# EAGLE schematic Schematic_V1 (EAGLE 9.1.3)
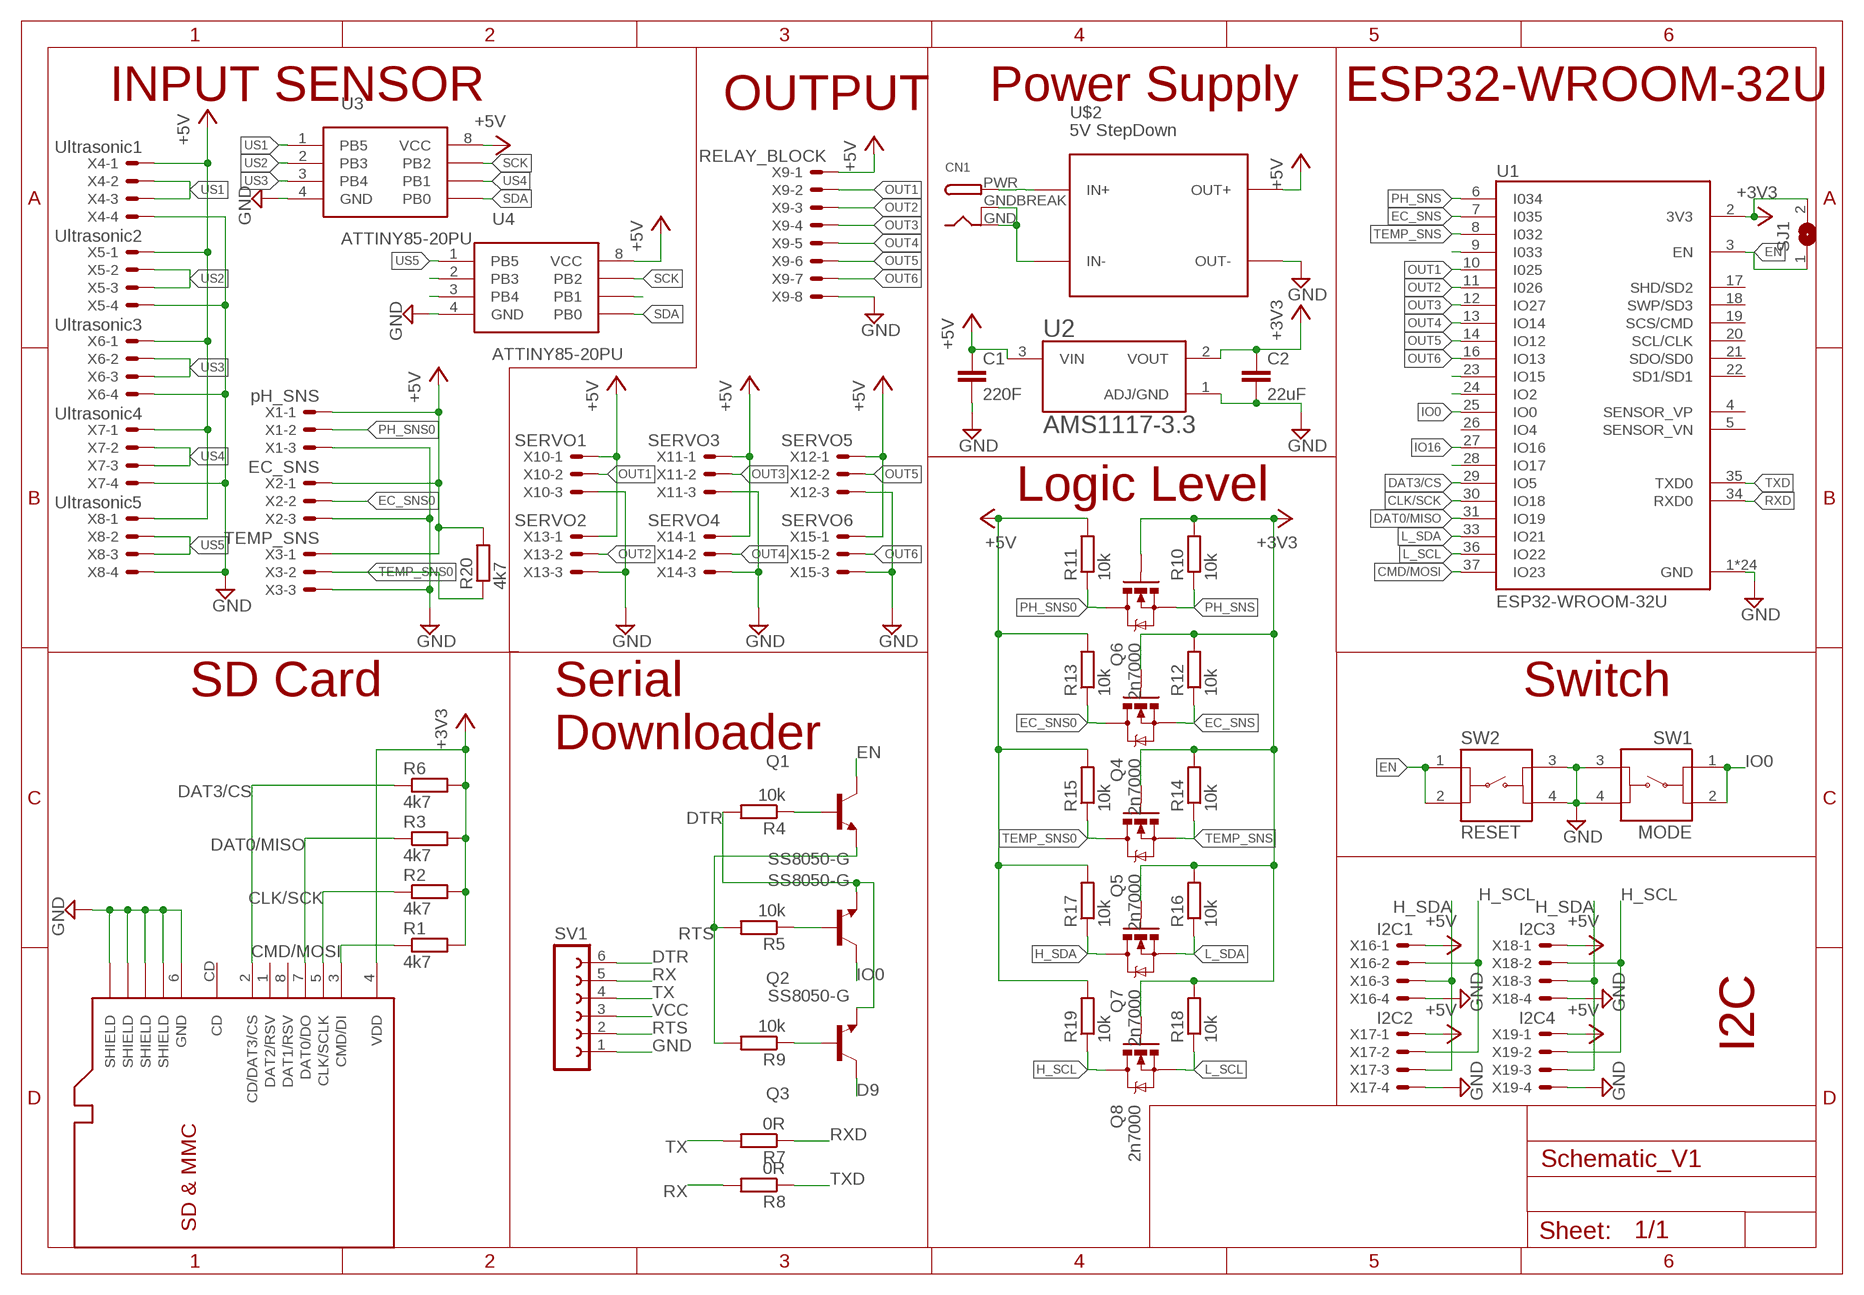
[diagram p0: schematic, sheet 1]

## Parts
C1  220F  C-EUC1206  [C1206]
C2  22uF  C-EUC1206  [C1206]
CN1  DCBARRELPTH  [DCJACK_2MM_PTH]
Q1  SS8050-G  MMBT3904  [SOT23]
Q2  SS8050-G  MMBT3904  [SOT23]
Q3  SS8050-G  MMBT3904  [SOT23]
Q4  2n7000  MOSFET-NCHANNELBSS138  [SOT23]
Q5  2n7000  MOSFET-NCHANNELBSS138  [SOT23]
Q6  2n7000  MOSFET-NCHANNELBSS138  [SOT23]
Q7  2n7000  MOSFET-NCHANNELBSS138  [SOT23]
Q8  2n7000  MOSFET-NCHANNELBSS138  [SOT23]
R1  4k7  R-EU_M1206  [M1206]
R2  4k7  R-EU_M1206  [M1206]
R3  4k7  R-EU_M1206  [M1206]
R4  10k  R-EU_M1206  [M1206]
R5  10k  R-EU_M1206  [M1206]
R6  4k7  R-EU_M1206  [M1206]
R7  0R  R-EU_M1206  [M1206]
R8  0R  R-EU_M1206  [M1206]
R9  10k  R-EU_M1206  [M1206]
R10  10k  R-EU_M1206  [M1206]
R11  10k  R-EU_M1206  [M1206]
R12  10k  R-EU_M1206  [M1206]
R13  10k  R-EU_M1206  [M1206]
R14  10k  R-EU_M1206  [M1206]
R15  10k  R-EU_M1206  [M1206]
R16  10k  R-EU_M1206  [M1206]
R17  10k  R-EU_M1206  [M1206]
R18  10k  R-EU_M1206  [M1206]
R19  10k  R-EU_M1206  [M1206]
R20  4k7  R-EU_M1206  [M1206]
SJ1  SJW  [SJW]
SV1  FE06-1  [FE06]
SW1  MODE  1825910-6  [1825910-6]
SW2  RESET  1825910-6  [1825910-6]
U1  ESP32-WROOM-32U  [XCVR_ESP32-WROOM-32U]
U2  AMS1117-3.3  [SOT229P700X180-4N]
U3  ATTINY85-20PU  [PDIP-8]
U4  ATTINY85-20PU  [PDIP-8]
U$1  MICROSD  [C12075]
U$2  5V StepDown  DC-DC-STEP-DOWN-LM2596  [DC-DC-STEP-DOWN-LM2596]
X1  pH_SNS  JST-XH-03-PIN-LONG-PAD  [JST-XH-03-PACKAGE-LONG-PAD]
X2  EC_SNS  JST-XH-03-PIN-LONG-PAD  [JST-XH-03-PACKAGE-LONG-PAD]
X3  TEMP_SNS  JST-XH-03-PIN-LONG-PAD  [JST-XH-03-PACKAGE-LONG-PAD]
X4  Ultrasonic1  JST-XH-04-PIN-LONG-PAD  [JST-XH-04-PACKAGE-LONG-PAD]
X5  Ultrasonic2  JST-XH-04-PIN-LONG-PAD  [JST-XH-04-PACKAGE-LONG-PAD]
X6  Ultrasonic3  JST-XH-04-PIN-LONG-PAD  [JST-XH-04-PACKAGE-LONG-PAD]
X7  Ultrasonic4  JST-XH-04-PIN-LONG-PAD  [JST-XH-04-PACKAGE-LONG-PAD]
X8  Ultrasonic5  JST-XH-04-PIN-LONG-PAD  [JST-XH-04-PACKAGE-LONG-PAD]
X9  RELAY_BLOCK  JST-XH-08-PIN-LONG-PAD  [JST-XH-08-PACKAGE-LONG-PAD]
X10  SERVO1  JST-XH-03-PIN-LONG-PAD  [JST-XH-03-PACKAGE-LONG-PAD]
X11  SERVO3  JST-XH-03-PIN-LONG-PAD  [JST-XH-03-PACKAGE-LONG-PAD]
X12  SERVO5  JST-XH-03-PIN-LONG-PAD  [JST-XH-03-PACKAGE-LONG-PAD]
X13  SERVO2  JST-XH-03-PIN-LONG-PAD  [JST-XH-03-PACKAGE-LONG-PAD]
X14  SERVO4  JST-XH-03-PIN-LONG-PAD  [JST-XH-03-PACKAGE-LONG-PAD]
X15  SERVO6  JST-XH-03-PIN-LONG-PAD  [JST-XH-03-PACKAGE-LONG-PAD]
X16  I2C1  JST-XH-04-PIN-LONG-PAD  [JST-XH-04-PACKAGE-LONG-PAD]
X17  I2C2  JST-XH-04-PIN-LONG-PAD  [JST-XH-04-PACKAGE-LONG-PAD]
X18  I2C3  JST-XH-04-PIN-LONG-PAD  [JST-XH-04-PACKAGE-LONG-PAD]
X19  I2C4  JST-XH-04-PIN-LONG-PAD  [JST-XH-04-PACKAGE-LONG-PAD]

## Nets
+3V3: C2.1 Q4.1(G) Q5.1(G) Q6.1(G) Q7.1(G) Q8.1(G) R1.2 R2.2 R3.2 R6.2 R10.2 R12.2 R14.2 R16.2 R18.2 SJ1.2 U1.2(3V3) U2.2(VOUT) U$1.4(VDD)
+5V: C1.1 R11.2 R13.2 R15.2 R17.2 R19.2 R20.2 U2.3(VIN) U3.8(VCC) U4.8(VCC) U$2.OUT+ X1.1 X2.1 X3.1 X4.1 X5.1 X6.1 X7.1 X8.1 X9.1 X10.1 X11.1 X12.1 X13.1 X14.1 X15.1 X16.1 X17.1 X18.1 X19.1
CLK/SCK: R2.1 U1.30(IO18) U$1.5(CLK/SCLK)
CMD/MOSI: R1.1 U1.23(IO15) U1.37(IO23) U$1.3(CMD/DI)
D9: Q3.3(C)
DAT0/MISO: R3.1 U1.31(IO19) U$1.7(DAT0/DO)
DAT3/CS: R6.1 U1.29(IO5) U$1.2(CD/DAT3/CS)
DTR: Q2.2(E) Q3.2(E) R4.2 SV1.6
EC_SNS: Q4.2(S) R12.1 U1.7(I035)
EC_SNS0: Q4.3(D) R13.1 X2.2
EN: Q1.3(C) SJ1.1 SW2.1 SW2.2 U1.3(EN)
GND: C1.2 C2.2 SV1.1 SW1.3 SW1.4 SW2.3 SW2.4 U1.1(GND) U1.15(GND) U1.38(GND) U1.G.1(GND) U1.G.2(GND) U1.G.4(GND) U1.G.5(GND) U1.G.6(GND) U1.G.7(GND) U1.G.8(GND) U1.G.9(GND) U1.G.10(GND) U1.G.11(GND) U1.G.12(GND) U1.G.13(GND) U1.G.14(GND) U1.G.15(GND) U1.G.16(GND) U1.G.17(GND) U1.G.18(GND) U1.G.19(GND) U1.G.20(GND) U1.G.21(GND) U1.G.22(GND) U2.1(ADJ/GND) U3.4(GND) U4.4(GND) U$1.6(GND) U$1.GND@1(SHIELD) U$1.GND@2(SHIELD) U$1.GND@3(SHIELD) U$1.GND@4(SHIELD) U$2.OUT- X1.3 X2.3 X3.3 X4.4 X5.4 X6.4 X7.4 X8.4 X9.8 X10.3 X11.3 X12.3 X13.3 X14.3 X15.3 X16.4 X17.4 X18.4 X19.4
H_SCL: Q8.3(D) R19.1 X16.2 X17.2 X18.2 X19.2
H_SDA: Q7.3(D) R17.1 X16.3 X17.3 X18.3 X19.3
IO0: Q2.3(C) SW1.1 SW1.2 U1.25(IO0)
IO16: U1.27(IO16)
L_SCL: Q8.2(S) R18.1 U1.36(IO22)
L_SDA: Q7.2(S) R16.1 U1.33(IO21)
N$1: CN1.PWR U$2.IN+
N$2: Q1.1(B) R4.1
N$3: Q2.1(B) R5.1
N$4: Q3.1(B) R9.1
N$5: U1.9(I033)
N$6: CN1.GND CN1.GNDBREAK U$2.IN-
N$7: U4.6(PB1)
N$12: U4.2(PB3)
N$13: U1.24(IO2)
N$14: U1.28(IO17)
N$15: U4.3(PB4)
OUT1: U1.10(I025) X9.2 X10.2
OUT2: U1.11(I026) X9.3 X13.2
OUT3: U1.12(IO27) X9.4 X11.2
OUT4: U1.13(IO14) X9.5 X14.2
OUT5: U1.14(IO12) X9.6 X12.2
OUT6: U1.16(IO13) X9.7 X15.2
PH_SNS: Q6.2(S) R10.1 U1.6(I034)
PH_SNS0: Q6.3(D) R11.1 X1.2
RTS: Q1.2(E) R5.2 R9.2 SV1.2
RX: R8.2 SV1.5
RXD: R7.1 U1.34(RXD0)
SCK: U3.7(PB2) U4.7(PB2)
SDA: U3.5(PB0) U4.5(PB0)
TEMP_SNS: Q5.2(S) R14.1 U1.8(I032)
TEMP_SNS0: Q5.3(D) R15.1 R20.1 X3.2
TX: R7.2 SV1.4
TXD: R8.1 U1.35(TXD0)
US1: U3.1(PB5) X4.2 X4.3
US2: U3.2(PB3) X5.2 X5.3
US3: U3.3(PB4) X6.2 X6.3
US4: U3.6(PB1) X7.2 X7.3
US5: U4.1(PB5) X8.2 X8.3
VCC: SV1.3
Unconnected: U1.4(SENSOR_VP) U1.5(SENSOR_VN) U1.17(SHD/SD2) U1.18(SWP/SD3) U1.19(SCS/CMD) U1.20(SCL/CLK) U1.21(SDO/SD0) U1.22(SD1/SD1) U1.26(IO4) U$1.1(DAT2/RSV) U$1.8(DAT1/RSV) U$1.CD

## Notes on the sheet
- INPUT SENSOR | OUTPUT | Power Supply | ESP32-WROOM-32U
- Logic Level
- SD Card | Switch
- Serial
  Downloader
- I2C

## Library data of the parts
C1 C2 = rcl:C-EU: CAPACITOR, European symbol; SPICEPREFIX: C
CN1 = adafruit:DCBARREL: 2.0mm DC Barrel Jack DCJACK_2MM_PTH - Through Hole Jack (4UConnector: 05537)
Q1-Q3 = Transistor:MMBT3904: TRANS NPN 40V 0.2A SOT-23 Manufacturer's datasheet <https://www.onsemi.com/pub/Collateral/PZT3904-D.pdf>; CREATED_BY: PCBLayout.com; DIGIKEY_PART_NUMBER: MMBT3904FSCT-ND; MANUFACTURER: ON Semiconductor; MPN: MMBT3904; PACKAGE: SOT-23-3
Q4-Q8 = BeagleBone_Blue_R3:MOSFET-NCHANNEL: Common NMOSFET Parts MFG P/N Store ID Prod ID FDD8780 TRANS-09984 SI7820DN TRANS-11055 FDS6630A IC-08089 2N7002PW TRANS-11151 FQP30N06L COM-10213 TRANS-10060 BSS123LT1G TRANS-08345 BSS138 TRANS-00830 BS170 2N7000; PROD_ID: TRANS-00830
R1-R20 = rcl:R-EU_: RESISTOR, European symbol; SPICEPREFIX: R
SJ1 = jumper:SJ: SMD solder JUMPER
SV1 = con-lsta:FE06-1: FEMALE HEADER; OC_FARNELL: unknown; OC_NEWARK: unknown
SW1 SW2 = Switch:1825910-6: SWITCH TACTILE SPST-NO 0.05A 24V Manufacturer's datasheet <https://www.te.com/commerce/DocumentDelivery/DDEController?Action=srchrtrv&DocNm=1825910&DocType=Customer+Drawing&DocLang=English>; CREATED_BY: PCBLayout.com; DIGIKEY_PART_NUMBER: 450-1650-ND; MANUFACTURER: TE Connectivity ALCOSWITCH Switches; MPN: 1825910-6
U1 = ESP32-WROOM-32U:ESP32-WROOM-32U: Wi-Fi/BT BLE Module ESP32-D0WD SPI Flash UART U.FL Conn.; AVAILABILITY: Unavailable; DESCRIPTION: Bluetooth, WiFi 802.11b/g/n, Bluetooth v4.2 +EDR, Class 1, 2 and 3 Transceiver Module 2.4GHz ~ 2.5GHz Antenna Not Included, U.FL Surface Mount; MF: Espressif Systems; MP: ESP32-WROOM-32U; PACKAGE: Module Espressif Systems; PRICE: None
U2 = AMS1117-3.3:AMS1117-3.3: Sot223/Pkg 1-Amp 3.3-Volt Low Drop Out Voltage Regulatator; AVAILABILITY: Unavailable; DESCRIPTION: Sot223/Pkg 1-Amp 3.3-Volt Low Drop Out Voltage Regulatator; MF: Advanced Monolithic Systems; MP: AMS1117-3.3; PACKAGE: None; PRICE: None
U3 U4 = Microcontroller:ATTINY85-20PU: IC MCU 8BIT 8KB FLASH 8DIP Manufacturer's datasheet <http://ww1.microchip.com/downloads/en/DeviceDoc/Atmel-2586-AVR-8-bit-Microcontroller-ATtiny25-ATtiny45-ATtiny85_Datasheet-Summary.pdf>; CREATED_BY: PCBLayout.com; DIGI_KEY_PART_NUMBER: ATTINY85-20PU-ND; MANUFACTURER: Microchip Technology; MPN: ATTINY85-20PU; PACKAGE: 8-PDIP
U$1 = micro-sd:MICROSD: Micro-SD / Transflash card holder with SPI pinout For the 3M # 2908-05WB-MG and/or 4UCON #19656 push-push type
U$2 = diy-modules:DC-DC-STEP-DOWN-LM2596: DC/DC Step-Down Regulator based on LM2596-ADJ chip LM2596 datasheet available here: http://www.ti.com/lit/ds/symlink/lm2596.pdf Click here to find device on ebay.com <http://www.ebay.com/sch/lm2596+power+regulator>
X1-X3 X10-X15 = Rembrandt Electronics - JST XH Connectors v1-0:JST-XH-03-PIN: JST XH Connector 2 Pin Wire to board connector. Pitch: 2,54 mm, (0.100") Number of pins: 3 Created by Rembrandt Electronics www.rembrandtelectronics.com
X4-X8 X16-X19 = Rembrandt Electronics - JST XH Connectors v1-0:JST-XH-04-PIN: JST XH Connector 2 Pin Wire to board connector. Pitch: 2,54 mm, (0.100") Number of pins: 4 Created by Rembrandt Electronics www.rembrandtelectronics.com
X9 = Rembrandt Electronics - JST XH Connectors v1-0:JST-XH-08-PIN: JST XH Connector 2 Pin Wire to board connector. Pitch: 2,54 mm, (0.100") Number of pins: 8 Created by Rembrandt Electronics www.rembrandtelectronics.com